# EAGLE board porta_stella (EAGLE 9.1.3)
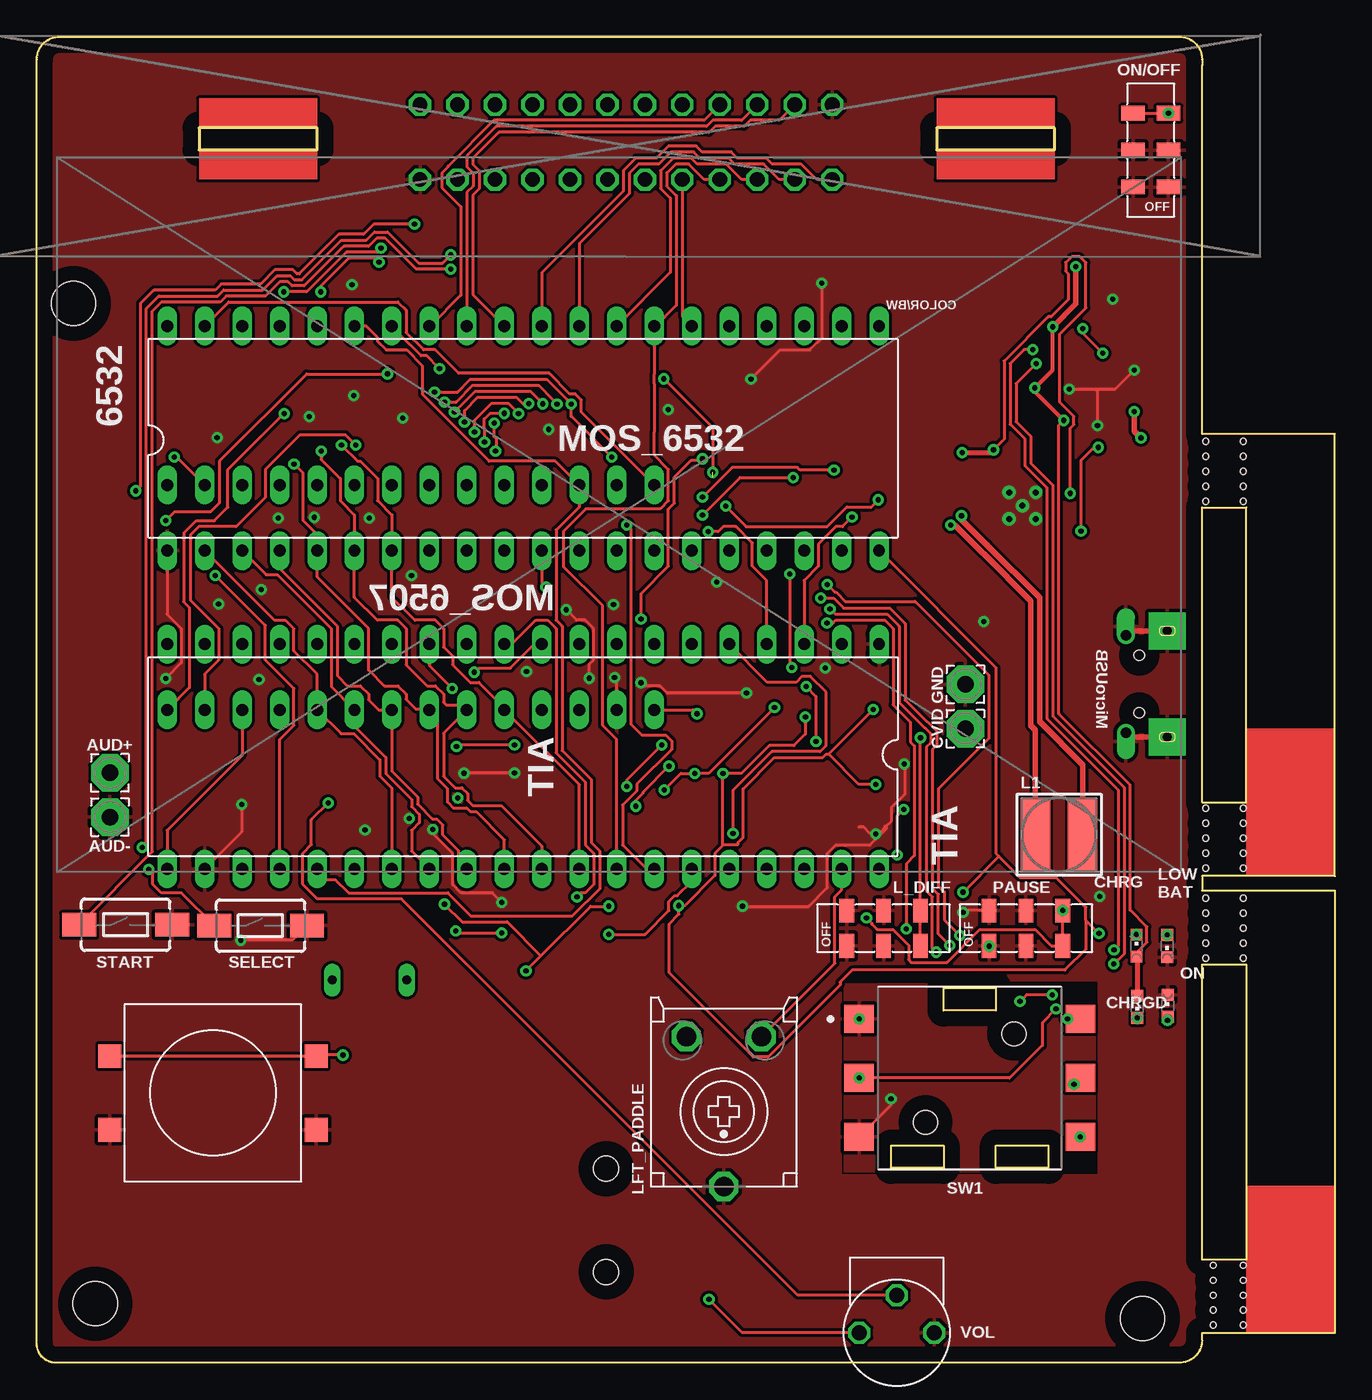
[diagram p2: board, top side]
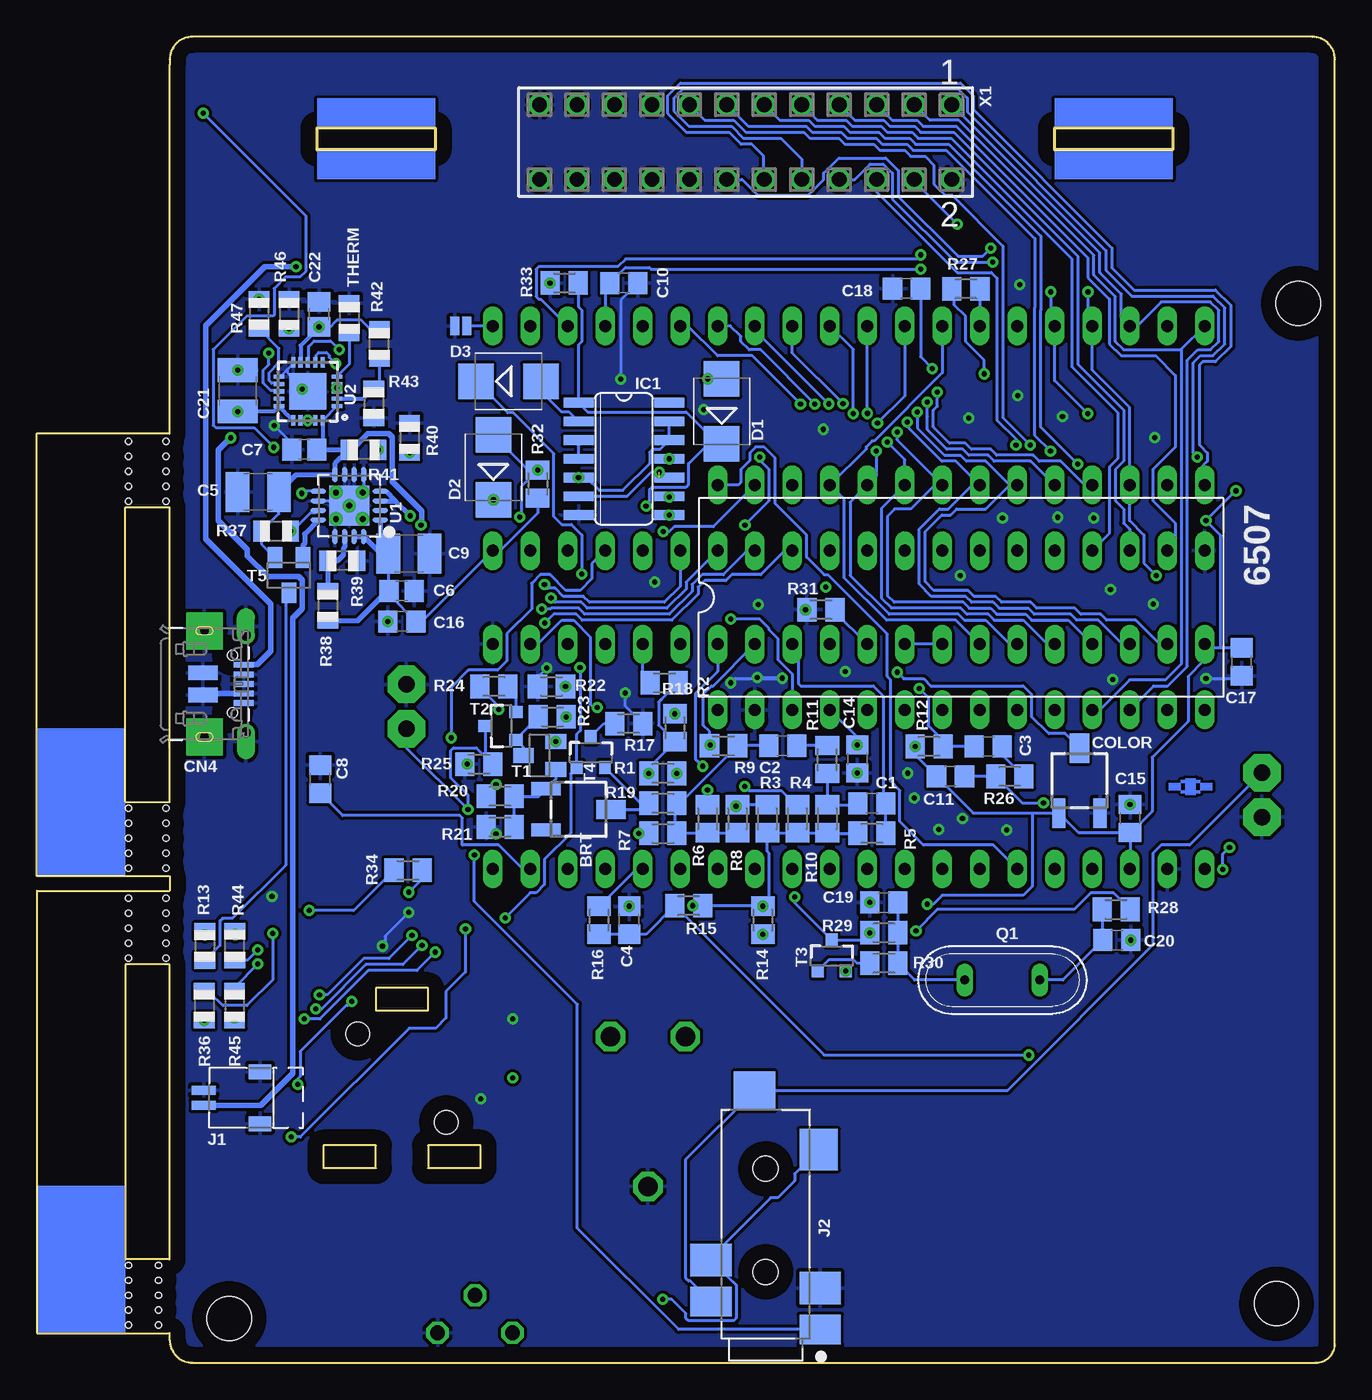
[diagram p3: board, bottom side, seen from below]

Size 88 x 89.92 mm. Coordinates in mm from the lower left corner, seen from the top.
Outline: 57.91,13.21 57.91,14.73 61.47,14.73 61.47,13.21 57.91,13.21
Outline: 65.02,13.21 65.02,14.73 68.58,14.73 68.58,13.21 65.02,13.21
Outline: 61.47,23.88 61.47,25.4 65.02,25.4 65.02,23.88 61.47,23.88
Outline: 1.27,0 arc-90 0,1.27 0,88.39 arc-90 1.52,89.92 77.47,89.92 arc-90 78.99,88.39 79,88 79,63 88,63 88,33 79,33 79,32 88,32 88,2 79,2 78.99,1.52 arc-90 77.47,0 1.27,0
Outline: 11,82.25 19,82.25 19,83.75 11,83.75 11,82.25
Outline: 61,82.25 69,82.25 69,83.75 61,83.75 61,82.25
Outline: 79,7 79,27 82,27 82,7 79,7
Outline: 79,38 79,58 82,58 82,38 79,38
Copper layers (1*16): Top 0.035mm / dielectric 1.5mm / Bottom 0.035mm
Design rules "default *": minimum track width 8mil, minimum drill 0.35mm, track to track 8mil, track to pad 8mil, pad to pad 8mil, via to via 8mil, smd to smd 0mil, copper to edge 40mil, drill to drill 8mil, minimum pad ring 10mil, minimum via ring 8mil, stop-mask expansion 4mil, vias tented up to drill 0mil, thermal gap 10mil
Holes 3 mm at 3.95,4 74.95,3 2.48,71.84
Holes 0.4 mm at 81.79,2.54 81.79,3.56 81.79,4.57 81.79,5.59 81.79,6.6 81.79,27.43 81.79,28.45 81.79,29.46 81.79,30.48 81.79,31.5 81.79,33.53 81.79,34.54 81.79,35.56 81.79,36.58 81.79,37.59 81.79,58.42 81.79,59.44 81.79,60.45 81.79,61.47 81.79,62.48 79.25,62.48 79.25,61.47 79.25,60.45 79.25,59.44 79.25,58.42 79.25,33.53 79.25,34.54 79.25,35.56 79.25,36.58 79.25,37.59 79.25,27.43 79.25,28.45 79.25,29.46 79.25,30.48 79.25,31.5 79.76,2.54 79.76,3.56 79.76,4.57 79.76,5.59 79.76,6.6

## Footprints (pad centres in the part's own frame; a part is rotated, then mirrored left to right if it is on the bottom)
DIL28 = drill 0.813 long: 1 -16.51,-7.62; 2 -13.97,-7.62; 3 -11.43,-7.62; 4 -8.89,-7.62; 5 -6.35,-7.62; 6 -3.81,-7.62; 7 -1.27,-7.62; 8 1.27,-7.62; 9 3.81,-7.62; 10 6.35,-7.62; 11 8.89,-7.62; 12 11.43,-7.62; 13 13.97,-7.62; 14 16.51,-7.62; 15 16.51,7.62; 16 13.97,7.62; 17 11.43,7.62; 18 8.89,7.62; 19 6.35,7.62; 20 3.81,7.62; 21 1.27,7.62; 22 -1.27,7.62; 23 -3.81,7.62; 24 -6.35,7.62; 25 -8.89,7.62; 26 -11.43,7.62; 27 -13.97,7.62; 28 -16.51,7.62
DIL40 = drill 0.813 long: 1 -24.13,-7.62; 2 -21.59,-7.62; 3 -19.05,-7.62; 4 -16.51,-7.62; 5 -13.97,-7.62; 6 -11.43,-7.62; 7 -8.89,-7.62; 8 -6.35,-7.62; 9 -3.81,-7.62; 10 -1.27,-7.62; 11 1.27,-7.62; 12 3.81,-7.62; 13 6.35,-7.62; 14 8.89,-7.62; 15 11.43,-7.62; 16 13.97,-7.62; 17 16.51,-7.62; 18 19.05,-7.62; 19 21.59,-7.62; 20 24.13,-7.62; 21 24.13,7.62; 22 21.59,7.62; 23 19.05,7.62; 24 16.51,7.62; 25 13.97,7.62; 26 11.43,7.62; 27 8.89,7.62; 28 6.35,7.62; 29 3.81,7.62; 30 1.27,7.62; 31 -1.27,7.62; 32 -3.81,7.62; 33 -6.35,7.62; 34 -8.89,7.62; 35 -11.43,7.62; 36 -13.97,7.62; 37 -16.51,7.62; 38 -19.05,7.62; 39 -21.59,7.62; 40 -24.13,7.62
2,54/1,1 = drill 1.118 pad 2.54 octagon: 1 0,0
3223G = smd 2 x 0.9: 1 -2.2,1.4; 3 -2.2,-1.4 | smd 2 x 1.3: 2 2.2,0
C0805 = smd 1.3 x 1.5: 1 -0.95,0; 2 0.95,0
C1210 = smd 1.6 x 2.7: 1 -1.4,0; 2 1.4,0
C0805' = smd 1.3 x 1.5: 1 -0.85,0; 2 0.85,0
ADAFRUIT_CHIPLED_0603 = smd 0.8 x 0.8: A 0,-0.75; C 0,0.75
4UCONN_20329 = smd 1 x 2: BASE@1 -0.75,-2; BASE@2 0.75,-2 | smd 0.4 x 1.35: D+ 0,0.775; D- -0.65,0.775; GND 1.3,0.775; ID 0.65,0.775; VBUS -1.3,0.775 | drill 0.7 offset: SPRT@1 -3.3,0.9; SPRT@2 3.3,0.9 | drill 0.6 pad 2.5 square: SPRT@3 -3.6,-1.9; SPRT@4 3.6,-1.9 | hole 0.7: -1.95,0; 1.95,0
DIODE_SMB = smd 2.4 x 2.4: A 2.2,0; C -2.2,0
SO14 = smd 0.66 x 2.032: 1 -3.81,-3.073; 2 -2.54,-3.073; 3 -1.27,-3.073; 4 0,-3.073; 5 1.27,-3.073; 6 2.54,-3.073; 7 3.81,-3.073; 8 3.81,3.073; 9 2.54,3.073; 10 1.27,3.073; 11 0,3.073; 12 -1.27,3.073; 13 -2.54,3.073; 14 -3.81,3.073
HW2-SMD-1.0-90D = smd 1.524 x 1.016: 3 -3.429,1.778; 4 -3.429,-1.778 | smd 1.651 x 0.635: + 0.381,0.508; - 0.381,-0.508
CUI_SJ-43516-SMT = smd 2 x 2.8: 1 -7.15,-3.7; 6 -5.25,3.7 | smd 2.8 x 2.6: 2 5.05,-3.6 | smd 2.2 x 2.8: 3 -2.45,3.7; 4 -4.35,-3.7 | smd 2.6 x 2.8: 5 9.05,0.75 | hole 1.7: -3.25,0; 3.75,0
SMT-JUMPER_2_NO_NO-SILK = smd 0.635 x 1.27: 1 -0.406,0; 2 0.406,0
INDUCTOR_5X5MM_TDK_VLC5045 = smd 2 x 5: P$1 -1.6,0; P$2 1.6,0
JS202011JCQN = smd 1 x 1.6: P$1 -2.5,1.2; P$2 0,1.2; P$3 2.5,1.2; P$4 -2.5,-1.2; P$5 0,-1.2; P$6 2.5,-1.2
ECP10S = drill 1.321 octagon: A -2.54,-5.08; E 2.54,-5.08; S 0,5.08
QS = drill 0.61 long: 1 -2.54,0; 2 2.54,0
M0805 = smd 1.3 x 1.6: 1 -0.95,0; 2 0.95,0
R0805 = smd 1.1 x 1.4: 1 -1,0; 2 1,0
TACTILE_SWITCH_SMD_6.0X3.5MM = smd 2.3 x 1.6: 1 -3.15,0; 2 3.15,0
E-SWITCH_JS5208_0 = smd 2 x 1.9: 1 -7.5,4; 2 -7.5,0; 3 -7.5,-4; 4 7.5,4; 5 7.5,0; 6 7.5,-4 | hole 1.6: 3,3; -3,-3
SOT23-BEC = smd 1 x 1.4: B -0.95,-1.1; C 0,1.1; E 0.95,-1.1
SOT23-3 = smd 0.8 x 0.9: 1 -0.95,-1; 2 0.95,-1; 3 0,1.1
TRANSISTOR_SC59-BEC = smd 1 x 1.4: B -0.95,-1.2; C 0,1.2; E 0.95,-1.2
PVQFN-16 = smd 1.05 x 0.35: 1 -2.1,0.975; 2 -2.1,0.325; 3 -2.1,-0.325; 4 -2.1,-0.975; 9 2.1,-0.975; 10 2.1,-0.325; 11 2.1,0.325; 12 2.1,0.975 | smd 0.35 x 1.05: 5 -0.975,-2.1; 6 -0.325,-2.1; 7 0.325,-2.1; 8 0.975,-2.1; 13 0.975,2.1; 14 0.325,2.1; 15 -0.325,2.1; 16 -0.975,2.1 | drill 0.4: P$18 0,0; P$19 -0.9,0.9; P$20 0.9,0.9; P$21 0.9,-0.9; P$22 -0.9,-0.9 | smd 2.7 x 2.7: THERMAL 0,0
QFN20_4MM = smd 0.73 x 0.28: P$1 -1.965,1; P$2 -1.965,0.5; P$3 -1.965,0; P$4 -1.965,-0.5; P$5 -1.965,-1; P$11 1.965,-1; P$12 1.965,-0.5; P$13 1.965,0; P$14 1.965,0.5; P$15 1.965,1 | smd 0.28 x 0.73: P$6 -1,-1.965; P$7 -0.5,-1.965; P$8 0,-1.965; P$9 0.5,-1.965; P$10 1,-1.965; P$16 1,1.965; P$17 0.5,1.965; P$18 0,1.965; P$19 -0.5,1.965; P$20 -1,1.965 | smd 2.5 x 2.5: P$21 0,0
TL3300DF260Q = smd 1.55 x 1.6: P$1 -7,2.5; P$2 7,2.5; P$3 -7,-2.5; P$4 7,-2.5
3352P-1-103LF = drill 1 octagon: P$1 2.54,2.54; P$2 -2.54,2.54; P$3 0,0
SSW-112-02-G-Q = drill 1 pad 1.5 octagon: 1 -13.97,-2.54; 2 -13.97,2.54; 3 -11.43,-2.54; 4 -11.43,2.54; 5 -8.89,-2.54; 6 -8.89,2.54; 7 -6.35,-2.54; 8 -6.35,2.54; 9 -3.81,-2.54; 10 -3.81,2.54; 11 -1.27,-2.54; 12 -1.27,2.54; 13 1.27,-2.54; 14 1.27,2.54; 15 3.81,-2.54; 16 3.81,2.54; 17 6.35,-2.54; 18 6.35,2.54; 19 8.89,-2.54; 20 8.89,2.54; 21 11.43,-2.54; 22 11.43,2.54; 23 13.97,-2.54; 24 13.97,2.54

## Placement (x,y rotation side)
6507  MOS_6507  [DIL28]  25.34,51.9 0 bottom
6532  MOS_6532  [DIL40]  32.96,62.69 0 top
AUD  AUD  [2,54/1,1]  4.95,40 90 top
BRT  5k  [3223G]  51.28,37.52 0 bottom
C1  47pF  [C0805]  31.39,37.93 180 bottom
C2  22pF  [C0805]  37.43,41.84 180 bottom
C3  100nF  [C0805]  23.49,41.79 0 bottom
C4  470pF  [C0805]  47.84,30 90 bottom
C5  10uF  [C1210]  73,59.05 180 bottom
C6  2.2uF  [C0805']  63.27,52.34 0 bottom
C7  0.1uF  [C0805']  69.87,61.93 180 bottom
C8  68nF  [C0805]  68.79,39.57 90 bottom
C9  10uF  [C1210]  62.77,54.87 0 bottom
C10  10nF  [C0805]  48.2,73.22 0 bottom
C11  820pF  [C0805]  26.05,39.76 180 bottom
C14  100nF  [C0805]  32.38,40.95 270 bottom
C15  100nF  [C0805]  13.89,36.91 90 bottom
C16  100nF  [C0805]  63.25,50.27 180 bottom
C17  100nF  [C0805]  6.32,47.53 270 bottom
C18  100nF  [C0805]  29.04,72.84 180 bottom
C19  47Pf  [C0805]  30.58,31.21 180 bottom
C20  47Pf  [C0805]  14.78,28.66 0 bottom
C21  10uF  [C1210]  74.39,65.91 90 bottom
C22  10uf  [C0805']  68.87,71.09 90 bottom
CHRG/LBO  ORANGE  [ADAFRUIT_CHIPLED_0603]  74.55,28.28 0 top
CN4  MicroUSB  [4UCONN_20329]  74.74,46.03 270 bottom
COLOR  500k  [3223G]  17.32,39.48 90 bottom
CVID  CVID  [2,54/1,1]  62.95,43 90 top
D1  [DIODE_SMB]  41.57,64.52 90 bottom
D2  [DIODE_SMB]  57.04,60.71 90 bottom
D3  [DIODE_SMB]  56.03,66.55 0 bottom
DONE  GREEN  [ADAFRUIT_CHIPLED_0603]  74.6,24.13 180 top
GND_A  GND_A  [2,54/1,1]  4.95,37 90 top
GND_CVID  GND_CVID  [2,54/1,1]  62.95,46 90 top
GOLD_ORB_SM1  OSHWLOGOLOGO5MM  [OSHW_5MM]  28,9 0 top
IC1  74LS00D  [SO14]  48.2,61.3 270 bottom
J1  2p-smd-1.0-90d  [HW2-SMD-1.0-90D]  76.3,17.96 180 bottom
J2  SJ-43516-SMT  [CUI_SJ-43516-SMT]  38.59,9.4 90 bottom
JP1  COLOR/BW  [SMT-JUMPER_2_NO_NO-SILK]  59.26,70.31 180 bottom
L1  6.8uH  [INDUCTOR_5X5MM_TDK_VLC5045]  69.3,35.81 0 top
L_DIFF  JS202011JCQN  [JS202011JCQN]  57.4,29.46 0 top
LBO  RED  [ADAFRUIT_CHIPLED_0603]  76.63,28.25 180 top
LFT_PADDLE  [ECP10S]  46.57,17.03 180 top
ON  BLUE  [ADAFRUIT_CHIPLED_0603]  76.66,24.19 0 top
ON/OFF  JS202011JCQN  [JS202011JCQN]  75.52,82.24 90 top
PAUSE  JS202011JCQN  [JS202011JCQN]  67.06,29.46 0 top
Q1  [QS]  22.55,25.95 0 bottom
R1  3.3k  [M0805]  45.56,39.96 0 bottom
R2  3.3k  [M0805]  45.46,46.11 180 bottom
R3  3.3k  [M0805]  38.48,36.89 90 bottom
R4  3.3k  [M0805]  36.44,36.89 90 bottom
R5  1k  [M0805]  31.39,35.9 0 bottom
R6  27k  [M0805]  42.54,36.89 90 bottom
R7  56k  [M0805]  45.56,35.9 180 bottom
R8  27k  [M0805]  40.51,36.89 90 bottom
R9  110k  [M0805]  41.45,41.84 180 bottom
R10  1k  [M0805]  34.41,36.89 90 bottom
R11  6.8k  [M0805]  34.41,40.9 270 bottom
R12  1k  [M0805]  27.5,41.79 0 bottom
R13  1K  [R0805]  76.62,28.26 270 bottom
R14  10k  [M0805]  38.78,30 90 bottom
R15  10k  [M0805]  43.81,30.99 0 bottom
R16  220  [M0805]  49.88,30 270 bottom
R17  1k  [M0805]  47.87,43.34 0 bottom
R18  24k  [M0805]  44.75,43.06 90 bottom
R19  1k  [M0805]  45.56,37.93 0 bottom
R20  3.3k  [M0805]  56.59,38.41 0 bottom
R21  1k  [M0805]  56.59,36.33 180 bottom
R22  68  [M0805]  53.11,45.85 180 bottom
R23  150  [M0805]  53.06,43.8 180 bottom
R24  18  [M0805]  57.02,45.85 0 bottom
R25  75  [M0805]  58.03,40.6 180 bottom
R26  18k  [M0805]  22.04,39.76 0 bottom
R27  24k  [M0805]  25.01,72.83 0 bottom
R28  15K  [M0805]  14.83,30.74 180 bottom
R29  150K  [M0805]  30.58,29.15 0 bottom
R30  390  [M0805]  30.58,27.09 0 bottom
R31  1K  [M0805]  34.84,51.06 0 bottom
R32  1.5k  [M0805]  54.05,59.59 90 bottom
R33  1k  [M0805]  52.24,73.23 180 bottom
R34  1k  [M0805]  62.83,33.4 180 bottom
R36  1K  [R0805]  76.65,24.2 270 bottom
R37  200K  [R0805]  71.78,56.39 0 bottom
R38  1.87M  [R0805]  68.28,51.33 270 bottom
R39  200K  [R0805]  67.29,54.37 180 bottom
R40  340K  [R0805]  62.73,62.71 270 bottom
R41  1.87M  [R0805]  65.85,61.91 180 bottom
R42  270K  [R0805]  64.78,69.09 90 bottom
R43  100K  [R0805]  65.16,65.07 270 bottom
R44  1K  [R0805]  74.58,28.28 90 bottom
R45  1K  [R0805]  74.59,24.21 270 bottom
R46  1.0K  [R0805]  70.91,71.13 270 bottom
R47  100K  [R0805]  72.94,71.13 270 bottom
S3  START  [TACTILE_SWITCH_SMD_6.0X3.5MM]  6.02,29.7 0 top
S4  SELECT  [TACTILE_SWITCH_SMD_6.0X3.5MM]  15.16,29.64 0 top
SW1  E-SWITCH_JS5208E-SWITCH_JS5208_0_0  [E-SWITCH_JS5208_0]  63.25,19.3 0 top
T1  2N3904  [SOT23-BEC]  53.92,41.18 90 bottom
T2  PN3906  [SOT23-3]  56.51,43.19 90 bottom
T3  PN3906  [SOT23-3]  34.11,27.57 0 bottom
T4  PN3906  [SOT23-3]  50.44,41.36 0 bottom
T5  MMUN2133LT1G  [TRANSISTOR_SC59-BEC]  70.91,53.4 180 bottom
THERM  15K  [R0805]  66.83,70.84 270 bottom
TIA  TIA  [DIL40]  32.96,41.1 180 top
U1  TPS61090RSAR  [PVQFN-16]  66.82,58.12 180 bottom
U2  MCP73871  [QFN20_4MM]  69.62,65.87 180 bottom
U$7  TL3300DF260Q  [TL3300DF260Q]  11.94,18.29 0 top
VOL  3352P-1-103LF  [3352P-1-103LF]  58.29,4.57 180 top
X1  SSW-112-02-G-Q  [SSW-112-02-G-Q]  39.95,82.78 180 bottom

## Tracks (layer width: path | path; a pad name or v marks a point on that pad's centre or on a via)
+5V  (via drill 0.35)
  Top 0.203: C14.1 28.57,41.9 R12.1 | T3.2 34.18,27.59 | 34.18,27.59 37.54,30.95 R14.2 | 46.51,35.09 45.97,34.54 45.97,33.03 43.92,30.99 v43.53,30.99 43.53,30.42 42.88,29.77 42.88,26.42 48.56,20.73 49.58,20.73 54.46,25.6 54.46,25.81 55.27,26.62 69.7,26.62 71.12,28.04 71.12,30 | 46.51,35.09 R1.1 47.77,39.96 49.66,41.85 51.33,41.85 52.1,42.63 R23.1 | 53.67,41.27 v56.69,44.3 | 46.51,35.09 46.53,35.15 47.55,35.15 47.55,35.28 47.88,35.61 47.88,38.92 50,41.04 53.27,41.04 53.51,41.27 53.67,41.27 | 65.23,34.34 65.02,34.54 65.02,47.14 6532.20 | 65.23,34.34 66.65,32.92 69.09,32.92 71.12,30.89 71.12,30 | 65.23,34.34 v62.79,31.9 | v23.77,67.06 18.29,67.06 12.39,61.16 12.39,58.32 11.79,57.71 9.35,57.71 v8.74,57.1 | 34.18,27.59 31.88,29.9 28.83,29.9 v27.64,31.09 | v56.87,39.21 55.73,39.21 53.67,41.27 | v72.01,29.11 71.12,30 | v25.6,77.22 22.84,77.22 22.16,76.53 20.47,76.53 17.8,73.85 17.62,73.85 17.36,74.12 16.12,74.12 15.16,73.16 12.49,73.16 12.09,72.75 7.93,72.75 7.01,71.83 7.01,59.44 v6.71,59.13
  Bottom 0.203: C15.1 13.89,33.51 TIA.23 | C15.1 17.4,35.96 COLOR.1 20.52,37.28 | R12.1 28.45,41.2 C11.2 24.53,37.28 20.52,37.28 | C14.1 32.38,42.42 6507.4 | R5.1 34.37,35.9 R10.1 R4.1 R3.1 38.48,34.67 38.35,34.54 38.35,31.39 R14.2 38.82,30.99 R15.2 v43.52,30.99 v43.53,30.99 | R1.1 46.51,40.35 R18.1 44.75,42.13 45.85,43.23 45.85,44.79 45.68,44.96 45.65,44.96 R2.1 | C9.1 64.17,54.76 64.17,52.39 C6.1 64.12,52.09 C16.1 61.9,50.27 6532.20 56.97,54.95 56.97,55.1 56.55,55.1 54.05,57.61 R32.1 | C17.1 7.72,48.48 | 7.72,48.48 8.59,48.48 TIA.20 8.94,48.56 8.94,47.55 9.96,46.53 9.96,43.48 12.39,41.05 12.39,37.39 13.82,35.97 C15.1 | v56.69,44.3 56.69,44.5 57.91,45.72 R24.1 | R36.1 76.61,25.03 76.2,25.03 75.39,24.21 73.76,24.21 71.98,25.99 71.98,29.08 v72.01,29.11 | v62.79,31.9 61.98,32.72 61.98,33.33 R34.1 | 7.72,48.48 7.72,56.08 v8.74,57.1 v6.71,59.13 | R27.1 25.81,72.75 25.81,71.73 25.04,70.96 25.04,69.25 23.77,67.99 v23.77,67.06 | v25.6,77.22 28.45,80.06 X1.4 | v27.64,31.09 27.23,31.09 26.62,31.7 21.13,31.7 20.52,32.31 20.52,37.28 | R20.1 56.87,39.08 v56.87,39.21
  Bottom 0.356: U1.1 64.72,55.41 C9.1 | 64.17,54.76 64.58,54.76 U1.16 U1.15 | R38.2 66.24,50.33 64.17,52.39
  other vias: 32.38,41.9 28.45,41.79 33.16,26.57 38.78,30.95 46.51,39.96 52.11,43.8
A0  (via drill 0.35)
  Top 0.203: TIA.32 36.77,39.2 6507.5 31.66,44.32 31.66,44.44 29.96,46.14 29.38,46.14 28.19,47.33 28.19,47.91 27.58,48.52 27.58,49.78 27.01,50.35 25.62,50.35 24.07,51.9 6532.7 24.07,57.49 23.11,58.46 23.11,59.97 21.93,61.14 21.74,61.14 v20.65,62.23
  Bottom 0.203: X1.15 42.7,84.26 40.74,84.26 39.92,83.45 35.99,83.45 35.59,83.04 33.62,83.04 33.22,82.63 31.25,82.63 30.84,82.23 29.16,82.23 28.76,81.82 27.79,81.82 27.18,81.21 27.18,79.94 26.42,79.18 25.96,79.18 22.5,75.73 22.5,64.09 v20.65,62.23
A1  (via drill 0.35)
  Top 0.203: TIA.31 34.23,35.03 31.48,37.78 29.55,37.78 29.21,38.13 29.21,38.59 28.81,38.99 28.35,38.99 27.58,39.76 27.58,42.7 6507.6 28.82,44.61 27.76,44.61 27.58,44.79 27.58,45.34 27.01,45.9 26.46,45.9 25.04,47.33 25.04,49.78 24.47,50.35 23.08,50.35 21.53,51.9 6532.6 21.53,57.49 20.57,58.46 20.57,59.97 19.28,61.26 v19.28,61.83
  Bottom 0.203: X1.13 39.76,83.85 35.83,83.85 35.42,83.45 33.45,83.45 33.05,83.04 31.08,83.04 30.68,82.63 28.99,82.63 28.59,82.23 26.34,82.23 20.35,76.23 20.35,71.56 20.36,71.54 20.36,62.92 v19.28,61.83
A2  (via drill 0.35)
  Top 0.203: v17.44,60.95 18.03,60.36 18.03,57.13 18.99,56.16 6532.5 18.99,53.29 22.5,49.78 22.5,46.97 23.57,45.9 24.47,45.9 25.04,45.34 25.04,44.99 25.69,44.34 26.55,44.34 6507.7 27.17,43.72 27.17,39.59 27.84,38.92 27.84,38.02 28.24,37.62 29.14,37.62 29.38,37.38 29.78,37.38 31.69,35.46 TIA.30
  Bottom 0.203: X1.11 37.62,84.26 35.66,84.26 35.25,83.85 33.29,83.85 32.88,83.45 30.91,83.45 30.51,83.04 28.83,83.04 28.42,82.63 26.17,82.63 19.94,76.4 19.94,71.39 19.96,71.37 19.96,63.48 v17.44,60.95
A3
  Top 0.203: 6532.4 16.45,53.86 20.36,49.95 20.36,46.59 21.05,45.9 21.93,45.9 22.5,45.34 22.5,44.94 23.16,44.28 6507.8 24.07,40.11 25.81,38.38 25.81,37.88 26.84,36.85 27.13,36.85 27.53,36.45 27.53,35.78 28.59,34.71 28.59,34.04 TIA.29
  Bottom 0.203: X1.9 35.08,84.26 33.12,84.26 32.71,83.85 30.75,83.85 30.34,83.45 28.66,83.45 28.25,83.04 26,83.04 19.59,76.63 17.83,74.87 17.83,67.54 14.73,64.44 14.73,61.31 15.29,60.75 15.29,56.24 6532.4
A4
  Top 0.203: TIA.28 25.41,34.69 25.41,36.1 25.93,36.62 25.93,37.19 25.41,37.71 25.41,38.21 23.67,39.95 23.67,41.05 21.53,43.18 6507.9 19.96,45.85 19.96,49.78 16.3,53.44 15.55,53.44 6532.3
  Bottom 0.203: X1.7 32.54,84.26 30.58,84.26 30.17,83.85 28.49,83.85 28.08,83.45 25.84,83.45 17.42,75.04 17.42,67.71 14.32,64.61 14.32,61.14 14.88,60.58 14.88,58.46 14.32,57.9 14.32,56.93 13.91,56.52 6532.3
A5
  Top 0.203: TIA.27 24.07,38.96 23.26,39.78 23.26,40.88 21.49,42.65 20.62,42.65 6507.10 18.99,46.7 17.42,48.27 17.42,49.78 16.85,50.35 16.1,50.35 6532.2
  Bottom 0.203: 6532.2 10.81,55.63 10.81,56.93 12.34,58.46 12.34,60.58 10.81,62.1 10.81,66.95 12.14,68.28 14.48,68.28 15.29,69.08 15.29,72.13 16.74,73.59 16.74,74.93 25.67,83.85 27.91,83.85 28.32,84.26 30,84.26 X1.5
A6
  Bottom 0.203: 6532.40 10.41,68.74 | 6507.11 15.94,44.28 13.91,46.31 11.49,46.31 10.41,47.39 10.41,68.74 | X1.3 27.46,84.26 25.5,84.26 16.34,75.1 16.34,73.76 14.88,72.3 14.88,69.25 14.31,68.69 10.46,68.69 10.41,68.74
A7
  Top 0.203: 6507.12 13.91,41.18 8.83,36.1 TIA.21
  Bottom 0.203: 6507.12 12.29,45.9 11.32,45.9 10,47.23 10,67.98 9.29,68.69 8.43,68.69 7.87,69.25 7.87,71.37 8.43,71.94 11.77,71.94 13.4,70.31 6532.38 14.47,70.87 14.47,72.47 15.93,73.92 15.93,75.26 X1.1
A8  (via drill 0.35)
  Top 0.203: 6507.13 11.37,46.7 12.34,47.66 12.34,49.78 10.41,51.71 10.41,56.13 10.97,56.7 13.51,56.7 15.49,58.67 15.49,60.58 17.83,62.92 20.93,62.92 v21.61,62.23 | v21.61,62.23
  Bottom 0.203: X1.6 31.06,79.4 25.6,73.93 23.29,73.93 22.91,73.56 22.91,63.92 21.61,62.62 v21.61,62.23
A9  (via drill 0.35)
  Top 0.203: v16.76,64.36 16.73,64.36 12.95,60.58 12.95,58.02 12.04,57.11 10.81,57.11 10,56.3 10,55.93 9.95,55.88 9.95,51.59 10.34,51.21 10.34,45.78 6507.14 | v23.19,74.62 22.91,74.9 21.14,74.9 19.26,73.01 v19.26,72.62
  Bottom 0.203: X1.8 32.56,80.24 31.5,81.3 30.62,81.3 30,80.68 30,78.91 25.71,74.62 v23.19,74.62 | v19.26,72.62 19.26,70.58 6532.36 18.99,66.59 v16.76,64.36
A10
  Bottom 0.203: 6507.15 9.19,59.87 9.19,60.59 8.64,61.14 8.64,61.7 9.19,62.26 9.19,67.64 8.95,67.88 8.1,67.88 7.06,68.92 7.06,71.71 8.1,72.75 13.61,72.75 15.12,74.26 15.12,75.6 24.52,85 24.52,85.92 25.38,86.78 44.37,86.78 45.23,85.92 45.23,84.71 43.96,83.45 41.08,83.45 40.26,82.63 39.53,82.63 38.73,81.84 38.73,80.29 X1.12
A11  (via drill 0.35)
  Top 0.203: 6507.16 9.47,61.42 v9.32,61.42
  Bottom 0.203: v9.32,61.42 9.6,61.7 9.6,67.81 9.12,68.28 8.27,68.28 7.46,69.08 7.46,71.54 8.27,72.35 13.78,72.35 15.52,74.09 15.52,75.43 24.92,84.83 24.92,85.76 25.54,86.38 44.2,86.38 44.82,85.76 44.82,84.88 43.79,83.85 40.91,83.85 40.09,83.04 37.57,83.04 36.14,81.61 X1.10
A12  (via drill 0.35)
  Top 0.203: TIA.24 16.45,42.25 17.42,43.22 17.42,45.73 15.49,47.66 15.49,49.99 v12.1,53.38 | v23.33,75.58 23.05,75.31 20.98,75.31 18.29,72.62 v16.74,72.62
  Bottom 0.203: 16.45,70.26 16.45,67.32 13.91,64.78 6507.17 13.91,57.1 12.95,56.13 12.95,54.23 v12.1,53.38 | 16.45,70.26 6532.37 | X1.14 40.18,80.24 39.12,79.18 35.7,79.18 34.66,80.22 34.66,80.68 33.63,81.7 30.45,81.7 29.6,80.84 29.6,79.08 25.55,75.03 23.88,75.03 v23.33,75.58 | v16.74,72.62 16.74,70.54 16.45,70.26
AUD  (via drill 0.35)
  Top 0.203: v45.57,4.29 47.83,2.03 VOL.P$1
  Bottom 0.203: J2.2 36.62,12.82 36.62,12.33 37.78,11.18 38.26,11.18 42.29,7.15 J2.3 40.8,5.45 40.77,5.45 40.59,5.27 40.59,3.02 40.77,2.84 43.82,2.84 44,3.02 44,3.34 44.95,4.29 v45.57,4.29
BOOST_ENABLE  (via drill 0.35)
  Top 0.203: R37.2 70.78,61.19 71.67,62.08 v71.95,62.08 | ON/OFF.P$3 ON/OFF.P$6
  Bottom 0.203: U1.11 69.09,57.63 69.46,57.63 70.7,56.4 R37.2 | v71.95,62.08 73.28,63.41 75.86,63.41 76.04,63.59 76.04,68.71 73.76,70.99 71.98,70.99 71.91,71.06 71.91,72.84 71.12,73.64 70.15,73.64 69.75,74.04 69.75,77.77 ON/OFF.P$6
  other vias: 70.78,56.39 76.72,84.74
CPU_RDY  (via drill 0.35)
  Top 0.203: v40.96,50.42 40.96,52.16 42.82,54.01 42.82,57.88 43.23,58.29 43.23,60.07 44.36,61.2 45.03,61.2 IC1.11
  Bottom 0.203: 6507.3 36.77,46.7 37.74,47.66 37.74,49.08 38.35,49.69 38.35,49.78 38.99,50.42 v40.96,50.42
  other vias: 45.13,61.3
CVID  (via drill 0.35)
  Top 0.203: v58.34,34.43 58.34,37.08 v58.77,37.51
  Bottom 0.203: T2.3 57.61,41.12 R25.1 57.1,40.6 58.21,41.7 59.76,41.7 59.94,41.52 59.94,39.67 58.77,38.5 v58.77,37.51 62.95,41.7 CVID.1 | J2.1 44.49,2.25 51.36,9.12 51.36,24.31 58.34,31.29 v58.34,34.43
D1
  Top 0.203: X1.17 45.24,84.26 30.99,84.26 27.89,81.16 27.89,81.1 27.46,80.68 27.46,79.7 28.75,78.42 28.75,72.39 26.67,70.31 6532.33
  Bottom 0.203: TIA.14 25.7,50.35 30.39,50.35 33.27,53.23 33.27,58.55 6507.25 31.78,61.97 31.78,62.11 31.38,62.51 31.24,62.51 26.61,67.14 6532.33
D2  (via drill 0.35)
  Top 0.203: v31.01,63.71 31.01,62.8 31.15,62.66 31.15,61.88 v31.1,61.83 | X1.19 47.78,84.26 45.82,84.26 45.41,83.85 31.16,83.85 29.15,81.85 29.15,81.1 29.58,80.68 29.58,79.8 29.15,79.37 6532.32
  Bottom 0.203: TIA.15 22.05,48.72 23.67,50.35 25.12,50.35 25.53,50.76 30.22,50.76 32.86,53.4 32.86,58.35 6507.24 31.1,60.12 v31.1,61.83 | 6532.32 29.15,65.56 v31.01,63.71
D3  (via drill 0.35)
  Top 0.203: v31.69,64.38 31.3,64.38 31.29,64.39 30.73,64.39 30.32,63.99 30.32,63.43 30.35,63.4 v30.35,62.44 | X1.21 50.32,84.26 48.36,84.26 47.95,83.85 45.99,83.85 45.58,83.45 33.38,83.45 31.32,83.45 29.56,81.68 29.56,81.27 30,80.83 30,79.64 29.56,79.19 29.56,72.45 6532.31
  Bottom 0.203: TIA.16 19.51,48.72 21.13,50.35 23.1,50.35 23.51,50.76 24.96,50.76 25.36,51.16 30.05,51.16 30.73,51.84 30.73,57.94 6507.23 29.15,61.24 v30.35,62.44 | v31.69,64.38 6532.31
D4  (via drill 0.35)
  Top 0.203: v32.65,64.37 32.37,64.65 32.37,64.67 31.97,65.07 30.82,65.07 29.68,63.92 29.68,63.51 29.67,63.5 v29.67,63.11 | X1.24 52.88,80.24 51.82,81.3 49.85,81.3 49.45,81.7 47.48,81.7 47.08,82.11 45.11,82.11 44.71,82.52 42.82,82.52 42.01,81.7 40.62,81.7 39.76,80.84 39.76,79.45 34.23,73.93 6532.30
  Bottom 0.203: TIA.17 18.08,50.35 20.56,50.35 20.97,50.76 22.93,50.76 23.34,51.16 24.79,51.16 25.19,51.57 29.88,51.57 30.32,52.01 30.32,57.41 29.84,57.89 28.75,57.89 27.13,59.52 6507.22 29.67,62.57 v29.67,63.11 | v32.65,64.37 32.65,68.73 6532.30
D5  (via drill 0.35)
  Top 0.203: v33.35,65.03 32.95,65.03 32.51,65.47 29.88,65.47 28.99,64.58 v28.99,63.79 | X1.22 50.34,80.24 49.28,81.3 47.31,81.3 46.91,81.7 44.94,81.7 44.54,82.11 42.99,82.11 42.17,81.3 40.78,81.3 40.16,80.68 40.16,79.29 36.77,75.9 6532.29
  Bottom 0.203: v33.35,65.03 36.77,68.46 6532.29 | TIA.18 14.43,48.72 16.05,50.35 17.5,50.35 17.91,50.76 20.39,50.76 20.8,51.16 22.76,51.16 23.17,51.57 24.62,51.57 25.03,51.98 27.35,51.98 28.19,52.81 28.19,56.52 26.82,57.89 26.21,57.89 24.59,59.52 6507.21 25.7,61.14 26.64,61.14 28.99,63.5 v28.99,63.79
D6  (via drill 0.35)
  Top 0.203: v34.31,65.03 34.03,65.3 34.03,65.31 33.46,65.88 29.71,65.88 v28.31,64.48 | 6532.28 42.95,73.95 42.95,78.98 42.3,79.63 42.3,80.84 43.16,81.7 44.37,81.7 44.77,81.3 46.74,81.3 47.8,80.24 X1.20
  Bottom 0.203: 22.05,59.52 23.67,57.89 25.64,57.89 26.05,57.49 26.65,57.49 27.78,56.35 27.78,52.98 27.18,52.38 24.86,52.38 24.45,51.98 23,51.98 22.59,51.57 20.63,51.57 20.22,51.16 17.62,51.16 17.22,50.76 15.89,50.76 15.48,50.35 13.51,50.35 11.89,48.72 TIA.19 | 6507.20 22.05,59.52 | 22.05,59.52 23.67,61.14 24.98,61.14 25.38,61.55 26.47,61.55 28.31,63.39 28.31,64.08 28.37,64.14 28.37,64.42 v28.31,64.48 | v34.31,65.03 39.31,70.03 6532.28
D7  (via drill 0.35)
  Top 0.203: v35.27,65.02 34.99,65.3 34.99,65.31 34.01,66.29 29.55,66.29 28.42,65.16 28.03,65.16 28.02,65.16 v27.63,65.16 | TIA.33 39.31,42.25 38.35,43.22 38.35,51.33 35.7,53.98 35.7,56.4 37.2,57.89 42.25,57.89 42.82,58.46 42.82,60.58 41.83,61.57 41.83,63.08 41.85,63.1 41.85,66.41 41.83,66.44 41.83,67 41.85,67.03 41.85,70.21 | 6532.27 41.85,70.21 | X1.18 45.26,80.24 44.2,81.3 43.32,81.3 42.7,80.68 42.7,79.8 43.36,79.15 43.36,71.71 41.85,70.21
  Bottom 0.203: v35.27,65.02 38.93,68.69 39.71,68.69 40.28,69.25 40.28,69.6 40.99,70.31 41.25,70.31 41.66,70.31 6532.27 | v27.63,65.16 27.63,64.76 27.63,64.19 27.63,63.29 26.3,61.96 25.22,61.96 24.81,61.55 23.51,61.55 23.1,61.14 20.62,61.14 6507.19
D8  (via drill 0.35)
  Top 0.203: v39.99,56.81 40.28,56.52 40.28,43.31 | v38.99,61.42 36.23,64.18 v36.23,65.01 35.95,65.29 35.95,65.3 34.56,66.69 29.38,66.69 28.52,65.84 27.35,65.84 27.34,65.83 v26.95,65.83 | 40.28,43.31 41.03,42.57 42.64,42.57 43.04,42.17 43.04,41.6 40.68,39.24 40.68,38.79 39.72,37.83 39.72,35.1 41.34,33.48 TIA.34 | X1.16 43.76,70.94 6532.26 | 40.28,43.31
  Bottom 0.203: v36.23,65.01 39.49,68.28 41.85,68.28 43.88,70.31 43.89,70.31 44.3,70.31 6532.26 | v38.99,61.42 38.99,61.22 38.35,60.58 38.35,58.73 38.35,58.45 v39.99,56.81 | v26.95,65.83 26.95,65.44 26.95,64.87 27.22,64.6 27.22,63.45 26.13,62.36 25.05,62.36 24.64,61.96 23.34,61.96 22.93,61.55 20.45,61.55 20.05,61.14 18.59,61.14 16.97,59.52 6507.18
GND  (via drill 0.35)
  Top 0.203: v57.91,17.88 57.91,17.48 55.88,15.44 SW1.3 | S4.2 17.34,28.66 C20.2 | C15.2 13.89,36 TIA.22 | C4.2 52.31,30.95 53.59,32.23 53.59,34.54 54.15,35.11 56.47,35.11 57.61,36.25 57.61,36.35 57.53,36.35 | 57.51,36.37 57.53,36.35 | 57.53,36.35 R21.2 | R21.2 57.07,35.87 v56.87,35.87 56.52,35.87 56.06,36.32 55.73,36.32 | PAUSE.P$1 62.92,30.66 v62.79,30.53 | v58.81,40.6 58.81,40.5 58.83,40.49 58.83,38.54 57.93,37.64 57.93,36.72 R21.2 | 6507.2 39.31,46.31 v39.17,46.46 | v37.46,46.41 37.46,47.38 37.74,47.66 37.74,49.78 37.17,50.35 36.6,50.35 v35.89,51.06 | TIA.1 | v48.11,45.41 42.74,45.41 42.25,45.9 41.17,45.9 v40.96,46.11 | 6532.1 8.83,50.75 9.8,49.78 9.8,47.47 v8.74,46.41 | v70,66.03 71.75,66.03 | 71.75,66.03 73.11,66.03 C21.2 | C14.2 28.98,40 v28.96,39.98 | v26.85,36.17 26.85,35.88 28.19,34.55 28.19,32.42 28.75,31.86 30.88,31.86 C19.2 | v71.91,63.55 71.91,65.88 71.75,66.03 | v48.41,66.7 50.4,68.69 52.41,68.69 53.24,69.51 53.24,73.2 v53.21,73.2 53.16,73.25
  Top 0.381: CN4.SPRT@4 73.84,42.43 CN4.SPRT@2 | CN4.SPRT@3 73.84,49.63 CN4.SPRT@1
  Bottom 0.203: 71.02,67.36 70.61,67.77 U2.P$10 | 71.02,67.36 71.42,66.95 U2.P$11 | U1.10 68.78,58.42 68.17,58.42 67.77,58.83 U1.P$21 | 71.02,67.36 71.02,67.16 69.8,65.94 U2.P$21 69.84,65.87 v70,66.03 | v62.79,30.53 64.39,28.93 64.39,28.25 64.52,28.25 | R21.2 57.07,35.87 v56.87,35.87 | R25.2 v58.81,40.6 | v39.17,46.46 37.5,46.46 v37.46,46.41 40.66,46.41 v40.96,46.11 | v35.89,51.06 R31.1 | R17.2 48.11,44.52 v48.11,45.41 | v8.74,46.41 6.49,46.41 C17.2 | U1.5 65.84,59.1 U1.P$22 | C7.2 70.72,62.36 v71.91,63.55 | C10.2 48.41,72.06 v48.41,66.7 | R22.2 54.06,46.5 v53.44,47.12 | 64.52,28.25 64.52,28.3 | 64.52,28.3 64.52,28.57 | v64.57,28.25 64.52,28.3 | v64.57,28.25 64.59,28.22 | R33.2 v53.21,73.2 | 64.52,28.25 v64.57,28.25
  Bottom 0.381: CN4.ID 76.74,45.38 CN4.BASE@2
  other vias: 13.83,28.66 13.89,37.86 47.84,30.95 74.39,67.31 22.25,36.12 25.25,36.91 28.52,38.3 32.38,40 31.53,31.21 64.2,50.27 46.1,52.93 12.32,51.46 15.06,46.33 25.4,53.39 18.47,64.16 21.49,65.58 24.82,64.06 34.7,63.3 39.09,51.41 42.8,64.64 33.2,46.86 15.21,52.43 16.36,57.28 18.8,57.33 22.53,57.28 72.06,31.62 12.22,62.74 21.36,73.1 72.94,72.13 55.75,23.3
  pour Top: -1,-1 80,-1 80,90 80,91 75,91 -1,91
  pour Bottom: -2,-2 -2,92 79.73,92 79.73,-2
JACK_AUD_OUT
  Bottom 0.203: AUD.1 9.84,35.11 11.77,35.11 12.34,34.54 12.34,28.32 22.21,18.45 J2.5 44,13.79 44,5.72 43.82,5.54 43.69,5.54 J2.6
LBO
  Bottom 0.356: U1.12 69.85,56.21 69.85,55.54 69.96,55.43 T5.B
LFT_FIRE  (via drill 0.35)
  Top 0.203: U$7.P$1 U$7.P$2 19.01,20.86 v20.76,20.86
  Bottom 0.203: R16.2 C4.1 46.7,29.05 R15.1 34.63,20.86 v20.76,20.86
LFT_JOY_DWN  (via drill 0.35)
  Top 0.203: v53.77,51.12 54.14,50.76 57.66,50.76 58.47,49.95 58.47,44.77 60.17,43.07 60.19,43.07 60.59,42.67 60.59,42.03 60.59,42.02 60.31,41.74 60.31,31.99 60.71,31.59 60.71,28.12 v60.98,27.84 | v69.88,23.3 SW1.4
  Bottom 0.203: v53.77,51.12 53.19,51.12 53.14,51.16 51.28,51.16 50.87,50.76 45.12,50.76 43.58,52.3 43.58,52.77 42.91,53.45 41.45,53.45 39.83,55.07 6532.13 | v60.98,27.84 62.23,26.59 65.52,26.59 68.81,23.3 v69.88,23.3
LFT_JOY_LFT  (via drill 0.35)
  Top 0.203: v53.15,51.84 54.01,51.84 54.7,51.16 57.83,51.16 58.87,50.12 58.87,44.94 60.34,43.47 60.35,43.47 61,42.83 61,41.86 60.72,41.58 60.72,32.16 61.12,31.76 61.12,29.07 v61.89,28.3 | v69.09,23.99 68.16,23.06 68.16,21.51 65.96,19.3 SW1.2
  Bottom 0.203: v53.15,51.84 52.87,51.57 51.11,51.57 50.7,51.16 45.29,51.16 43.99,52.47 43.99,52.94 6532.14 | v61.89,28.3 63.18,27 65.69,27 68.7,23.99 v69.09,23.99
  other vias: 55.75,19.3
LFT_JOY_RGT  (via drill 0.35)
  Top 0.203: v53.58,52.77 54.1,52.25 54.18,52.25 54.8,51.63 59.55,51.63 64.53,46.65 64.53,42.33 61.12,38.92 61.12,32.33 61.52,31.93 61.52,30.02 v62.57,28.97 | v68.83,24.95 67.1,24.95 v66.65,24.5 | v70.31,18.87 SW1.5
  Bottom 0.203: 6532.15 44.39,52.63 45.46,51.57 50.53,51.57 50.94,51.98 52.31,51.98 52.86,52.53 53.34,52.53 v53.58,52.77 | v62.57,28.97 64.14,27.41 65.86,27.41 68.31,24.95 v68.83,24.95 | v66.65,24.5 66.92,24.22 67.04,24.22 70.15,21.11 70.15,19.42 70.31,19.26 v70.31,18.87
LFT_JOY_UP  (via drill 0.35)
  Top 0.203: v53.57,50.16 53.96,50.16 54.15,50.35 57.49,50.35 58.06,49.78 58.06,44.6 59.22,43.44 59.22,42.1 59.5,41.82 59.5,34.39 58.94,33.84 v58.94,29.42
  Bottom 0.203: v53.57,50.16 52.97,50.76 51.45,50.76 51.04,50.35 44.95,50.35 43.17,52.13 43.17,52.6 42.74,53.04 41.29,53.04 40.88,53.45 38.91,53.45 37.29,55.07 6532.12 | v58.94,29.42 58.94,26.5 60.27,25.17 60.27,23.38 60.97,22.68 62.76,22.68 70.14,15.3 SW1.6
  other vias: 70.75,15.3
LFT_PADDLE_A
  Top 0.203: LFT_PADDLE.A 54.1,27.09 54.1,31.59 54.55,32.05 TIA.39
  Bottom 0.203: TIA.39 55.07,33.48 56.69,35.11 59.15,35.11 59.15,36.93 59.33,37.1 67.28,37.1 C8.1
N$1  (via drill 0.35)
  Top 0.203: v42.54,38.84 43.66,39.96 R1.2 45.55,39.96 v50.01,44.42
  Bottom 0.203: R6.2 v42.54,38.83 v42.54,38.84 | v50.01,44.42 50.26,44.42 50.49,44.66 50.49,49.23 51.61,50.35 52.41,50.35 54.04,48.72 TIA.2
  other vias: 44.61,39.96
N$2  (via drill 0.35)
  Top 0.203: TIA.5 49.52,46.14 51.47,46.14 51.87,46.54 52.44,46.54 53.5,45.47 53.5,41.85 53.1,41.45 49.83,41.45 47.2,38.81 v47.2,35.9
  Bottom 0.203: R2.2 46.93,46.63 TIA.5 | R7.2 v47.2,35.9
N$3  (via drill 0.35)
  Top 0.203: v42.85,40.45 41.09,38.68 41.09,38.62 40.6,38.13 v40.6,37.74
  Bottom 0.203: R3.2 40.41,37.84 | 40.41,37.84 R8.2 | v42.85,40.45 43.14,40.73 43.17,40.73 43.35,40.91 43.35,45.38 41.85,46.88 TIA.7 | v40.6,37.74 40.5,37.74 40.41,37.84
N$4  (via drill 0.35)
  Top 0.203: v42.35,41.88 40,39.53 v40,39.07
  Bottom 0.203: TIA.8 42.13,45.9 42.25,45.9 42.82,45.34 42.82,43.22 42.4,42.8 R9.2 v42.35,41.88 | v40,39.07 39.72,38.79 37.55,38.79 36.59,37.84 R4.2
N$5
  Bottom 0.203: R5.2 C1.1 30.6,38.09 30.6,45.21 31.29,45.9 36.22,45.9 36.37,46.05 36.37,48.32 TIA.9
N$6
  Bottom 0.203: R11.2 R10.2 32.43,37.84 C1.2
N$7
  Bottom 0.203: R11.1 C2.1
N$9  (via drill 0.35)
  Top 0.203: TIA.35 44.39,32.64 43.43,31.67 43.24,31.67 42.84,31.27 42.84,30.65 41.25,29.05 R14.1
  other vias: 38.78,29.05
N$10  (via drill 0.35)
  Top 0.381: L1.P$2 70.9,40.55 67.98,43.47 67.98,51.89 64.41,55.46
  Top 0.406: v62.68,57.44 62.68,57.19 64.41,55.46
  Bottom 0.356: U1.3 63.7,58.45 | 63.7,58.45 v62.68,57.44 | U1.4 64.35,59.1 63.7,58.45
N$11
  Bottom 0.203: R16.1 47.35,33.48 TIA.36
N$12  (via drill 0.35)
  Top 0.203: v70.05,58.95 70.05,63.37 70.31,63.62 70.31,64.19 69.32,65.18 69.32,69.72 71.12,71.52 71.12,74.6 70.72,75 70.15,75 69.75,74.6 69.75,74.04 69.94,73.85 69.94,72.11 68.75,70.93 68.57,70.93 65.58,67.94 65.58,62.63 R41.1
  Top 0.356: R40.2 64.66,61.71 R41.1
  Bottom 0.203: U1.9 69.91,59.1 v70.05,58.95
  other vias: 62.73,61.71 64.85,61.91
N$13
  Bottom 0.203: BRT.2 46.92,37.52 R19.1 47.06,37.93 T4.2
N$14
  Bottom 0.203: R21.1 R20.2 53.99,38.41 BRT.1 52.82,39.58 T1.B
N$15  (via drill 0.35)
  Top 0.203: R22.1 52.82,45.19 T1.E
  other vias: 52.16,45.85 52.82,42.13
N$16
  Bottom 0.203: T1.C 55.02,41.75 T2.1 55.51,42.29 R23.2
N$17  (via drill 0.35)
  Top 0.203: v29.66,46.82 29.94,47.1 32.09,47.1 33.72,48.72 TIA.10
  Bottom 0.203: COLOR.2 18.29,42.65 19.39,42.65 20.57,43.83 20.57,45.34 21.13,45.9 27.4,45.9 27.89,46.4 29.23,46.4 v29.66,46.82
N$18  (via drill 0.35)
  Top 0.203: S3.1 7.82,34.65 7.82,71.33 8.43,71.94 12.43,71.94 12.83,72.35 15.5,72.35 16.46,73.31 17.02,73.31 17.3,73.03 18.12,73.03 20.81,75.72 22.49,75.72 23.05,76.27 23.61,76.27 25.71,74.17 v28.06,74.17
  Bottom 0.203: 6532.24 49.47,72.9 C10.1 48.1,74.27 46.48,74.27 46.38,74.17 v28.06,74.17
N$19  (via drill 0.35)
  Top 0.203: S4.1 9.79,31.86 8.43,31.86 7.87,32.42 7.87,33.18 v7.59,33.46 | v7.14,34.94 7.42,35.21 7.42,71.5 8.27,72.35 12.26,72.35 12.66,72.75 15.33,72.75 16.29,73.71 17.19,73.71 17.46,73.45 17.97,73.45 20.64,76.12 22.32,76.12 22.88,76.67 23.78,76.67 25.87,74.58 27.5,74.58 27.78,74.86 27.79,74.86 v28.06,75.13
  Bottom 0.203: v7.59,33.46 7.59,34.48 v7.14,34.94 | v28.06,75.13 28.34,74.86 48.09,74.86 48.61,74.33 53.97,74.33 54.15,74.15 54.15,72.3 53.97,72.12 53.82,72.12 6532.23
N$20
  Bottom 0.203: 6532.21 JP1.1
N$21  (via drill 0.35)
  Top 0.203: L_DIFF.P$6 L_DIFF.P$3 v59.9,42.38
  Bottom 0.203: v59.9,42.38 59.9,43.84 59.9,45.8 58.74,46.96 56.77,46.96 56.13,47.6 56.13,49.43 54.46,51.1 54.46,52.86 53.87,53.45 53.21,53.45 52.14,52.38 51.17,52.38 50.37,53.19 50.37,54.18 6532.17
N$22  (via drill 0.35)
  Bottom 0.356: R13.1 LBO.A
  other vias: 76.63,29
N$23  (via drill 0.35)
  Top 0.203: 6507.1 44.48,44.28 R18.2
  other vias: 44.75,44.01
N$24
  Bottom 0.203: T2.2 55.51,45.3 R24.2
N$26
  Bottom 0.203: C3.2 22.54,41.2 R26.2
N$27  (via drill 0.35)
  Top 0.203: TIA.13 26.61,47.27 v28.17,45.71
  Bottom 0.203: C3.1 R12.2 26.55,42.19 27.58,43.22 27.58,45.12 v28.17,45.71 | TIA.13 TIA.12
N$28  (via drill 0.35)
  Top 0.203: v19.75,37.96 18.62,36.83 18.62,35.13 18.03,34.54 18.03,32.42 19,31.45 24.71,31.45 51.59,4.57 VOL.P$3
  Bottom 0.203: C11.1 R26.1 21.2,37.96 v19.75,37.96
N$29  (via drill 0.35)
  Top 0.203: 6532.34 24.41,70.31 24.63,70.09 24.63,69.69 26.05,68.28 26.44,68.28 v27.3,67.42
  Bottom 0.203: R27.2 24.06,70.32 6532.34 | C18.1 28.09,68.21 v27.3,67.42
N$30
  Bottom 0.203: 15.98,28.91 C20.1 | C20.1 15.73,30.69 R28.2 | C20.1 18.43,25.95 Q1.2
N$31
  Bottom 0.203: C19.1 R29.2 R30.2 28.49,25.95 Q1.1
N$32  (via drill 0.35)
  Top 0.203: v28.39,29.29 28.54,29.15 R29.1 | TIA.11 32.21,48.72 33.83,50.35 34.63,50.35 35.2,49.78 35.2,41.35 37.18,39.37 37.18,35.1 37.74,34.54 37.74,32.42 37.17,31.86 36.9,31.86 v36.62,31.58
  Bottom 0.203: R28.1 13.9,30.74 15,31.84 16.55,31.84 17.66,30.74 26.94,30.74 v28.39,29.29 | R29.1 32,28.68 T3.3 36.62,31.19 v36.62,31.58 | TIA.11 33.89,50.92 R31.2
  other vias: 31.53,29.15
N$33
  Bottom 0.203: R30.1 32.39,27.09 32.63,27.33 34.3,27.33 T3.1
N$34
  Bottom 0.203: T4.3 49.56,43.34 R17.1
N$35  (via drill 0.35)
  Top 0.203: IC1.8 47.67,60.03 IC1.5
  Bottom 0.203: IC1.13 IC1.12 45.77,61.93 46.27,61.93 46.45,61.75 46.45,60.98 48.27,59.16 49.89,59.16 50.75,60.03 IC1.5
  other vias: 45.13,57.49 51.28,60.03
N$36
  Bottom 0.203: IC1.2 51.91,64.47 52.42,64.47 53.83,65.88 D3.A
N$37
  Bottom 0.356: U1.14 67.14,55.31 67.22,55.23 67.22,54.78 67.63,54.38 R39.2 68.29,52.34 R38.1
N$38
  Bottom 0.203: IC1.4 IC1.3
N$39  (via drill 0.35)  (1 unrouted)
  Top 0.203: v42.51,66.72 45.81,63.42 v45.81,60.38
  Bottom 0.203: IC1.10 45.81,60.03 | IC1.6 47.98,58.76 46.35,60.38 v45.81,60.38 | D1.A v42.51,66.72
N$40  (via drill 0.35)
  Top 0.203: v46.7,58.09 48.09,56.7 53.58,56.7 54.92,58.04 56.57,58.04 D2.C
  Bottom 0.203: R33.1 51.29,71.62 51.05,71.37 51.05,69.25 51.29,69.01 IC1.1 50.64,64.47 43.99,64.47 41.84,62.32 D1.C 42.46,62.32 43.81,60.98 43.81,59.57 43.99,59.39 46.27,59.39 46.45,59.21 46.45,58.33 v46.7,58.09
  other vias: 57.04,58.51
N$41
  Bottom 0.203: R13.2 75.59,28.29 75.59,29.96 75.41,30.14 74.74,30.14 71.14,33.74 71.14,51.98 T5.C
N$42  (via drill 0.35)
  Top 0.356: R36.2 76.66,23.21 ON.A
  other vias: 76.65,23.2
N$43
  Bottom 0.203: R42.1 64.78,66.45 R43.1
  Bottom 0.279: U2.P$2 65.86,65.37 R43.1
N$44  (via drill 0.35)
  Top 0.203: v67.75,67.75 66.4,66.4 66.4,63.82 67.38,62.83 67.38,61.01 68.88,59.51 68.88,58.45 68.88,43.84 73.71,39.02 73.71,27.71 73.31,27.31 73.3,27.31 v73.02,27.04
  Bottom 0.203: U2.P$7 69.07,67.89 69.07,68.33 68.89,68.51 68.36,68.51 68.18,68.33 68.18,68.18 v67.75,67.75 | v73.02,27.04 74.59,25.46 R45.1
N$45  (via drill 0.35)
  Top 0.203: v67.51,68.71 66.93,68.71 65.99,67.77 65.99,63.65 66.98,62.66 66.98,60.84 68.48,59.34 68.48,43.67 73.3,38.85 73.3,28.27 v73.03,28
  Bottom 0.203: U2.P$8 69.57,67.89 69.57,68.92 69.2,69.29 68.09,69.29 v67.51,68.71 | v73.03,28 73.74,27.28 R44.1
N$46  (via drill 0.35)
  Top 0.203: v72.27,68.47 70.91,69.84 R46.2
  Bottom 0.203: U2.P$13 71.64,65.93 72.16,65.93 72.67,66.44 72.67,67.31 72.27,67.7 v72.27,68.47
  other vias: 70.91,70.13
N$47
  Bottom 0.203: THERM.2 66.83,67.7 U2.P$5
N$48  (via drill 0.35)
  Bottom 0.356: DONE.C R45.2
  other vias: 74.6,23.38
N$49  (via drill 0.35)
  Bottom 0.356: R44.2 74.55,29.25 CHRG/LBO.C
  other vias: 74.55,29.03
N$50
  Bottom 0.203: R47.2 71.59,68.78 71.59,67.81 72.26,67.14 72.26,66.61 72.08,66.43 71.64,66.43 U2.P$12
P_SW  (via drill 0.35)
  Top 0.203: v51.05,53.47 51.05,47.27 v51.18,47.15 | PAUSE.P$3 PAUSE.P$6 68.79,28.26 67.68,29.37 63.93,29.37 61.72,27.16 59.28,27.16 59.1,27.34 59.1,28.3 58.03,29.37 56.97,29.37 56.6,29.74 56.6,29.81 v56.25,30.16 | PAUSE.P$3 | v69.55,30.66 PAUSE.P$3
  Bottom 0.203: D3.C 56.09,64.42 55.72,64.42 52.94,61.64 52.94,57.37 52.42,56.85 51.77,56.85 51.05,56.13 v51.05,53.47 | v51.18,47.15 v51.17,47.15 51.15,47.15 51.15,42.87 51.39,42.63 T4.1 51.81,39.93 51.81,35.9 53.59,34.13 53.59,32.42 54.15,31.86 54.55,31.86 v56.25,30.16 | R34.2 66.52,30.66 v69.55,30.66
PHI_0  (via drill 0.35)
  Top 0.203: TIA.4 49.47,53.05 48.51,54.01 48.51,55.6 47.41,56.7 46.53,56.7 46.19,56.36 v45.53,56.36
  Bottom 0.203: 6507.27 42.13,56.7 44.79,56.7 45.13,56.36 v45.53,56.36
PHI_2
  Top 0.203: 6507.28 36.91,64.46 36.91,65.3 36.51,65.7 36.13,65.7 34.73,67.1 28.59,67.1 27,68.69 26.21,68.69 25.04,69.86 25.04,71.37 24.47,71.94 13,71.94 6532.39
  Bottom 0.203: TIA.26 23.16,35.11 27.9,35.11 29.48,36.7 29.48,38.8 30.12,39.44 30.12,46.31 30.34,46.54 30.34,49.4 34.39,53.45 34.63,53.45 35.81,54.62 35.81,56.13 37.94,58.27 37.94,61.34 38.7,62.1 39.27,62.1 39.67,61.7 39.67,61.19 40.28,60.58 40.28,59.7 40.46,59.52 6507.28
R/W
  Top 0.203: TIA.25 18.99,33.05 19.3,32.75 20.25,32.75 21.13,31.86 27.86,31.86 29.41,30.3 36.31,30.3 38.15,32.14 38.15,34.71 37.59,35.27 37.59,39.53 35.6,41.52 35.6,49.95 35.2,50.35 35.2,56.47 36.77,58.04 6507.26 35.15,61.14 30.67,61.14 26.14,65.67 26.14,67.62 25.07,68.69 23.67,68.69 23.11,69.25 23.11,69.53 22.33,70.31 6532.35
RAW_CVID
  Bottom 0.203: C2.2 R9.1 44.32,38.02 44.3,38 44.5,38 R19.2 44.7,37.8 44.7,35.97 R7.1 44.57,35.94 R6.1 R8.1
RGT_JOY_RGT  (via drill 0.35)
  Top 0.203: 6532.11 34.23,52.9 v34.52,52.61
TIA_RDY  (via drill 0.35)
  Top 0.203: v55.26,57.36 54.6,56.7 54.15,56.7 52.98,55.52 52.98,54.01 52.01,53.05 TIA.3 | R32.2 51.73,60.55 51.56,60.71 47.13,60.71 v45.13,58.71
  Bottom 0.203: D2.A 54.67,60.55 R32.2 54.05,60.53 55.15,59.42 55.15,57.47 v55.26,57.36 | v45.13,58.71 IC1.9
  other vias: 54.05,60.54
VBAT  (via drill 0.35)
  Top 0.381: L1.P$1 67.7,42.42 | 67.7,42.42 67.7,42.92 67.4,43.23 67.4,51.65 64.18,54.86 64.16,54.86 62.22,56.8 v61.96,56.8 | 67.7,42.42
  Bottom 0.203: T5.E 72.78,55.52 R37.1 71.6,57.58 C5.1 | U2.P$1 U2.P$20 | C7.1 68.96,61.87 68.78,61.87 68.61,61.91
  Bottom 0.279: U2.P$20 68.62,61.92 68.61,61.91
  Bottom 0.356: C5.1 70.43,60.22 U1.8 67.79,60.97 66.99,61.77 | R41.2 66.99,61.77 | 68.61,61.91 67.13,61.91 66.99,61.77
  Bottom 0.381: R41.2 66.66,61.91 65.57,63 64.14,63 63.91,62.77 63.91,59.75 61.91,57.76 61.91,57.12 61.96,57.07 v61.96,56.8
VBUS  (via drill 0.35)
  Top 0.203: CHRG/LBO.A 74.55,27.8 75.25,28.5 75.25,29.56 74.11,30.69 74.11,39.18 69.29,44.01 69.29,63.57 U2.P$18
  Top 0.279: U2.P$18 U2.P$3 v67.66,66.11 68.87,67.32 C22.1
  Top 0.356: CHRG/LBO.A 74.6,27.48 DONE.A
  Top 0.381: v70.43,74.32 70.43,71.81 C22.1
  Bottom 0.203: C22.1 68.72,70.09 68.26,70.09 67.65,70.7 66,70.7 65.39,70.09 R42.2
  Bottom 0.279: U2.P$3 v67.66,66.11 U2.P$4 | U2.P$19 U2.P$18 U2.P$17 | C22.1 70.12,68.99 U2.P$9
  Bottom 0.381: CN4.VBUS 73.06,47.33 72.14,48.26 72.14,51.46 76.54,55.86 76.54,70.34 72.56,74.32 v70.43,74.32
  other vias: 69.62,63.91 68.87,70.24
VLIPO  (via drill 0.35)
  Top 0.381: v74.85,62.72 74.39,63.19 C21.1
  Bottom 0.279: U2.P$15 71.95,64.51 C21.1 | U2.P$14 U2.P$15 | U2.P$15 71.22,64.5 71.22,64.48 71.02,64.28 71,64.28 U2.P$16
  Bottom 0.381: v74.85,62.72 75.69,61.88 75.69,57.12 73.73,55.16 73.73,54.71 72.31,53.3 70.25,53.3 70.02,53.07 70.02,51.14 70.65,50.51 70.65,19.62 72.82,17.45 J1.+
  other vias: 74.39,64.51
(copper drawn outside any net)
  shapes: Bottom area x58, Top area x6

## Text on the board
tNames: GND | AUD+ | AUD- | CHRG | LOW / BAT | ON | CHRGD
bNames: T5
tStop: TinyTari Portable | Designed 10 Miles from Sunnyvale | Board Rev 1.0
tDocu: screen